# EAGLE design freezer_alarm (EAGLE 9.6.2)
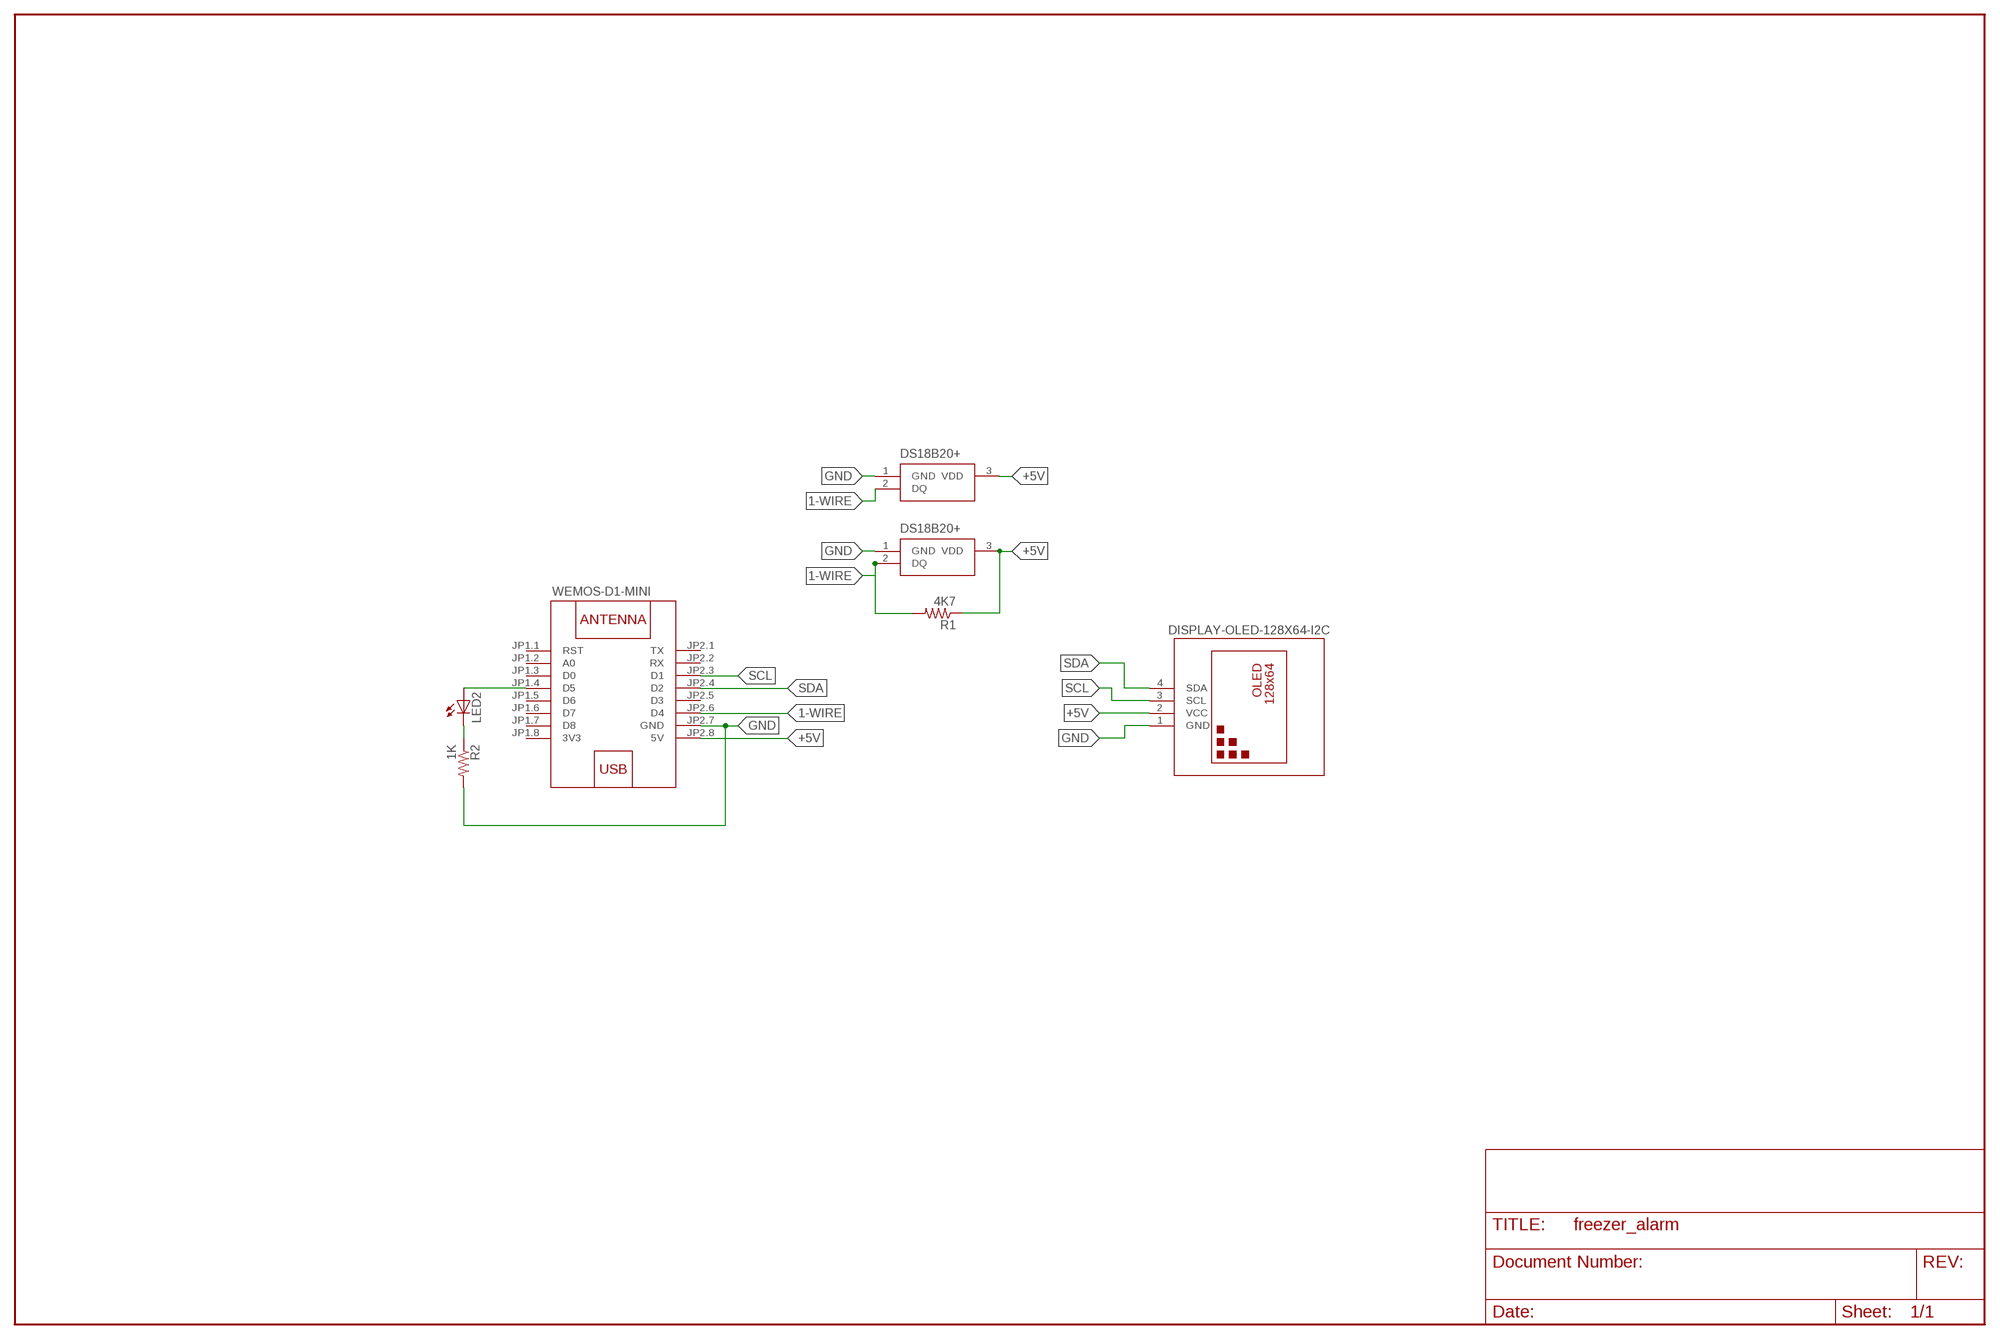
[diagram p0: schematic, sheet 1]

## Parts
DISP  DISPLAY-OLED-128X64-I2C  [DISPLAY-OLED-128X64-I2C]
IC1  DS18B20+  [TO-92]
IC2  DS18B20+  [TO-92]
LED2  LED5MM  [LED5MM]
R1  4K7  R-US_0207/10  [0207/10]
R2  1K  R-US_0207/10  [0207/10]
W1  WEMOS-D1-MINI  [WEMOS-D1-MINI]

## Nets
1-WIRE: IC1.2(DQ) IC2.2(DQ) R1.2 W1.JP2.6(D4)
+5V: DISP.2(VCC) IC1.3(VDD) IC2.3(VDD) R1.1 W1.JP2.8(5V)
GND: DISP.1(GND) IC1.1(GND) IC2.1(GND) R2.2 W1.JP2.7(GND)
N$1: LED2.A W1.JP1.4(D5)
N$2: LED2.K(C) R2.1
SCL: DISP.3(SCL) W1.JP2.3(D1)
SDA: DISP.4(SDA) W1.JP2.4(D2)
Unconnected: W1.JP1.1(RST) W1.JP1.2(A0) W1.JP1.3(D0) W1.JP1.5(D6) W1.JP1.6(D7) W1.JP1.7(D8) W1.JP2.1(TX) W1.JP2.2(RX) W1.JP2.5(D3)

## Power pins joined to a net without a drawn wire
3V3: W1.JP1.8(3V3)

## Library data of the parts
DISP = diy-modules:DISPLAY-OLED-128X64-I2C: 128x64 Dot Matrix OLED Module based on SSD1306 chip Variant with I2C interface More details available here: http://www.instructables.com/id/Monochrome-096-i2c-OLED-display-with-arduino-SSD13/ SSD1306 datasheet: https://cdn-shop.adafruit.com/datasheets/SSD1306.pdf Click here to find device on ebay.com <http://www.ebay.com/sch/oled+display+128x64+iic> Note: There are two variants: I2C and SPI. Search for the proper version.
IC1 IC2 = SamacSys_Parts:DS18B20+: DS18B20 prog thermometer 1-Wire, TO92 Source: Datasheet <https://componentsearchengine.com/Datasheets/1/DS18B20 .pdf>; DESCRIPTION: DS18B20 prog thermometer 1-Wire, TO92; HEIGHT: mm; MANUFACTURER_NAME: Maxim Integrated; MANUFACTURER_PART_NUMBER: DS18B20+; MOUSER_PART_NUMBER: 700-DS18B20+; MOUSER_PRICE-STOCK: https://www.mouser.com/Search/Refine.aspx?Keyword=700-DS18B20%2B
LED2 = adafruit:LED: LED OSRAM: - CHIPLED LG R971, LG N971, LY N971, LG Q971, LY Q971, LO R971, LY R971 LH N974, LH R974 LS Q976, LO Q976, LY Q976 LO Q996 - Hyper CHIPLED LW Q18S LB Q993, LB Q99A, LB R99A - SideLED LS A670, LO A670, LY A670, LG A670, LP A670 LB A673, LV A673, LT A673, LW A673 LH A674 LY A675 LS A676, LA A676, LO A676, LY A676, LW A676 LS A679, LY A679, LG A679 - Hyper Micro SIDELED® LS Y876, LA Y876, LO Y876, LY Y876 LT Y87S - SmartLED LW L88C, LW L88S LB L89C, LB L89S, LG L890 LS L89K, LO L89K, LY L89K LS L896, LA L896, LO L896, LY L896 - TOPLED LS T670, LO T670, LY T670, LG T670, LP T670 LSG T670, LSP T670, LSY T670, LOP T670, LYG T670 LG T671, LOG T671, LSG T671 LB T673, LV T673, LT T673, LW T673 LH T674 LS T676, LA T676, LO T676, LY T676, LB T676, LH T676, LSB T676, LW T676 LB T67C, LV T67C, LT T67C, LS T67K, LO T67K, LY T67K, LW E67C LS E67B, LA E67B, LO E67B, LY E67B, LB E67C, LV E67C, LT E67C LW T67C LS T679, LY T679, LG T679 LS T770, LO T770, LY T770, LG T770, LP T770 LB T773, LV T773, LT T773, LW T773 LH T774 LS E675, LA E675, LY E675, LS T675 LS T776, LA T776, LO T776, LY T776, LB T776 LHGB T686 LT T68C, LB T68C - Hyper Mini TOPLED® LB M676 - Mini TOPLED Santana® LG M470 LS M47K, LO M47K, LY M47K Source: http://www.osram.convergy.de/
R1 R2 = adafruit:R-US_: RESISTOR, American symbol
W1 = diy-modules:WEMOS-D1-MINI: WEMOS D1 mini: Mini Wi-Fi Board based on ESP-8266 device More details can be found here: https://www.wemos.cc/product/d1-mini.html Click here to find device on ebay.com <http://www.ebay.com/sch/wemos+d1+mini+nodemcu>

## Board
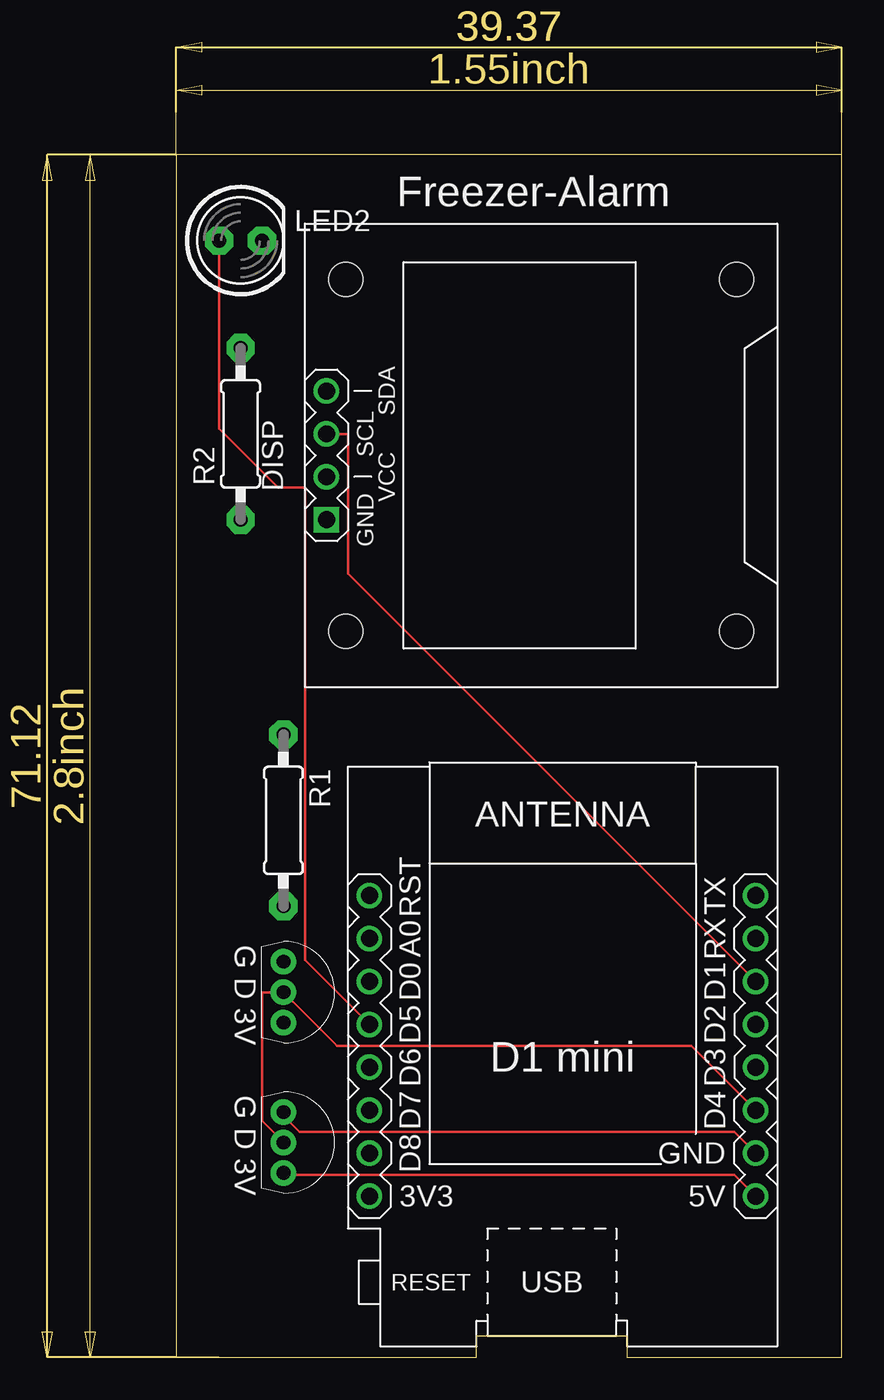
[diagram p1: board, top side]
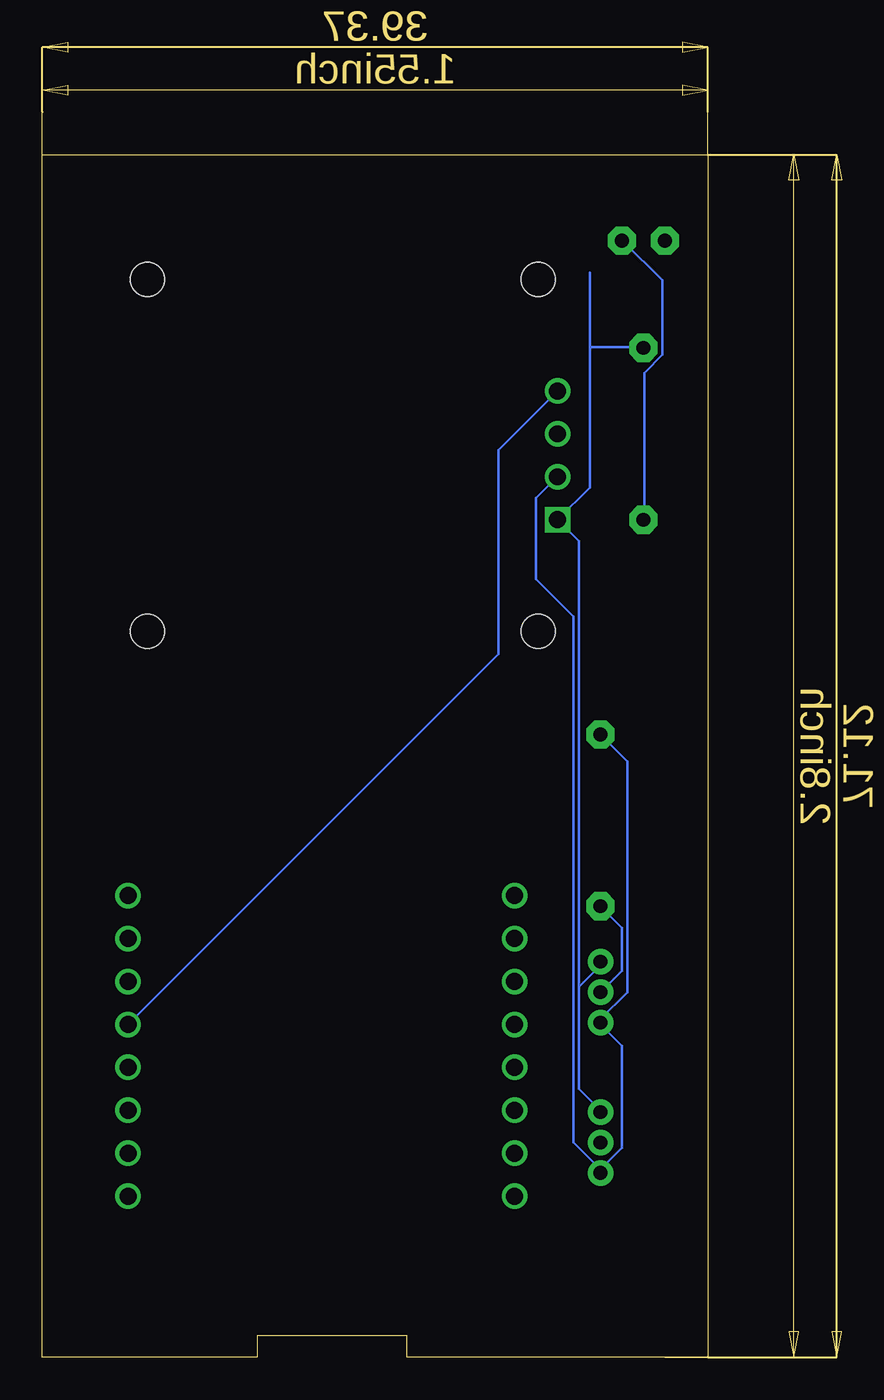
[diagram p2: board, bottom side, seen from below]

Size 39.37 x 71.12 mm. Coordinates in mm from the lower left corner, seen from the top.
Outline: 0,0 17.78,0 17.78,1.27 26.67,1.27 26.67,0 39.37,0 39.37,71.12 0,71.11 0,0
Copper layers (1*16): Top 0.035mm / dielectric 1.5mm / Bottom 0.035mm
Design rules "default": minimum track width 6mil, minimum drill 0.35mm, track to track 6mil, track to pad 6mil, pad to pad 6mil, via to via 6mil, smd to smd 6mil, copper to edge 40mil, drill to drill 6mil, minimum pad ring 10mil, minimum via ring 8mil, stop-mask expansion 4mil, vias tented up to drill 0mil, thermal gap 10mil

### Footprints (pad centres in the part's own frame; a part is rotated, then mirrored left to right if it is on the bottom)
DISPLAY-OLED-128X64-I2C = drill 1 square: 1 -3.81,12.7 | drill 1: 2 -1.27,12.7; 3 1.27,12.7; 4 3.81,12.7 | hole 2: -10.414,11.557; 10.414,11.557; 10.414,-11.557; -10.414,-11.557
TO-92 = drill 0.81 pad 1.51: 1 0,-1.8; 2 0,0; 3 0,1.8
LED5MM = drill 0.813 pad 1.676 octagon: A -1.27,0; K 1.27,0
0207/10 = drill 0.813 pad 1.676 octagon: 1 -5.08,0; 2 5.08,0
WEMOS-D1-MINI = drill 1: JP1.1 -11.43,9.525; JP1.2 -11.43,6.985; JP1.3 -11.43,4.445; JP1.4 -11.43,1.905; JP1.5 -11.43,-0.635; JP1.6 -11.43,-3.175; JP1.7 -11.43,-5.715; JP1.8 -11.43,-8.255; JP2.1 11.43,9.525; JP2.2 11.43,6.985; JP2.3 11.43,4.445; JP2.4 11.43,1.905; JP2.5 11.43,-0.635; JP2.6 11.43,-3.175; JP2.7 11.43,-5.715; JP2.8 11.43,-8.255

### Placement (x,y rotation side)
DISP  21.59,53.34 90 top
IC1  6.35,21.59 180 top
IC2  6.35,12.7 180 top
LED2  3.81,66.04 0 top
R1  6.35,31.75 270 top
R2  3.81,54.61 90 top
W1  22.86,17.78 0 top

### Tracks (layer width: path | path; a pad name or v marks a point on that pad's centre or on a via)
1-WIRE
  Top 0.152: W1.JP2.6 30.48,18.41 9.53,18.41 IC1.2 5.08,21.59 5.08,13.97 IC2.2
  Bottom 0.152: R1.2 5.08,25.4 5.08,22.86 IC1.2
+5V
  Top 0.152: W1.JP2.8 33.02,10.79 6.35,10.79 IC2.3
  Bottom 0.152: DISP.2 10.16,50.8 10.16,46.04 7.94,43.81 7.94,12.7 6.35,11.11 | 6.35,11.11 5.08,12.38 5.08,18.41 6.35,19.68 IC1.3 6.35,20 4.76,21.59 4.76,35.24 R1.1 | 6.35,11.11 IC2.3
GND
  Top 0.152: W1.JP2.7 33.02,13.34 7.3,13.34 6.35,14.29 IC2.1
  Bottom 0.152: 6.99,64.14 6.99,59.74 | 6.99,59.74 6.99,51.44 DISP.1 7.62,48.26 7.62,21.91 | 7.62,21.91 6.35,23.18 IC1.1 | 7.62,21.91 7.62,15.88 6.35,14.61 IC2.1 | 6.99,59.74 3.91,59.74 R2.2
N$1
  Top 0.152: W1.JP1.4 7.62,23.5 7.62,51.44 6.03,51.44 2.54,54.93 LED2.A
N$2
  Bottom 0.152: R2.1 3.76,49.53 3.76,58.22 2.69,59.28 2.69,63.7 4.98,65.99 LED2.K
SCL
  Top 0.152: W1.JP2.3 10.16,46.35 10.16,54.61 DISP.3
SDA
  Bottom 0.152: W1.JP2.4 12.38,41.59 12.38,53.66 DISP.4

### Text on the board
tNames: Freezer-Alarm | G D 3V | G D 3V